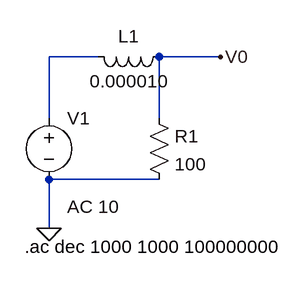
[diagram p0: schematic 1-krets-d.asc]
1-krets-d.asc, the LTspice schematic file:
Version 4
SHEET 1 880 680
WIRE 240 96 176 96
WIRE 400 96 320 96
WIRE 176 176 176 96
WIRE 320 176 320 96
WIRE 320 256 176 256
WIRE 176 320 176 256
FLAG 176 320 0
FLAG 400 96 V0
SYMBOL voltage 176 160 R0
WINDOW 123 24 132 Left 0
WINDOW 39 0 0 Left 0
SYMATTR Value2 AC 10
SYMATTR InstName V1
SYMATTR Value ""
SYMBOL ind 336 80 R90
WINDOW 0 5 56 VBottom 0
WINDOW 3 32 56 VTop 0
SYMATTR InstName L1
SYMATTR Value 0.000010
SYMBOL res 304 160 R0
SYMATTR InstName R1
SYMATTR Value 100
TEXT 144 344 Left 0 !.ac dec 1000 1000 100000000

The netlist it stands for:
* 1-krets-d.asc
V1 N001 0 AC 10
L1 V0 N001 0.000010
R1 V0 0 100
.ac dec 1000 1000 100000000
.backanno
.end